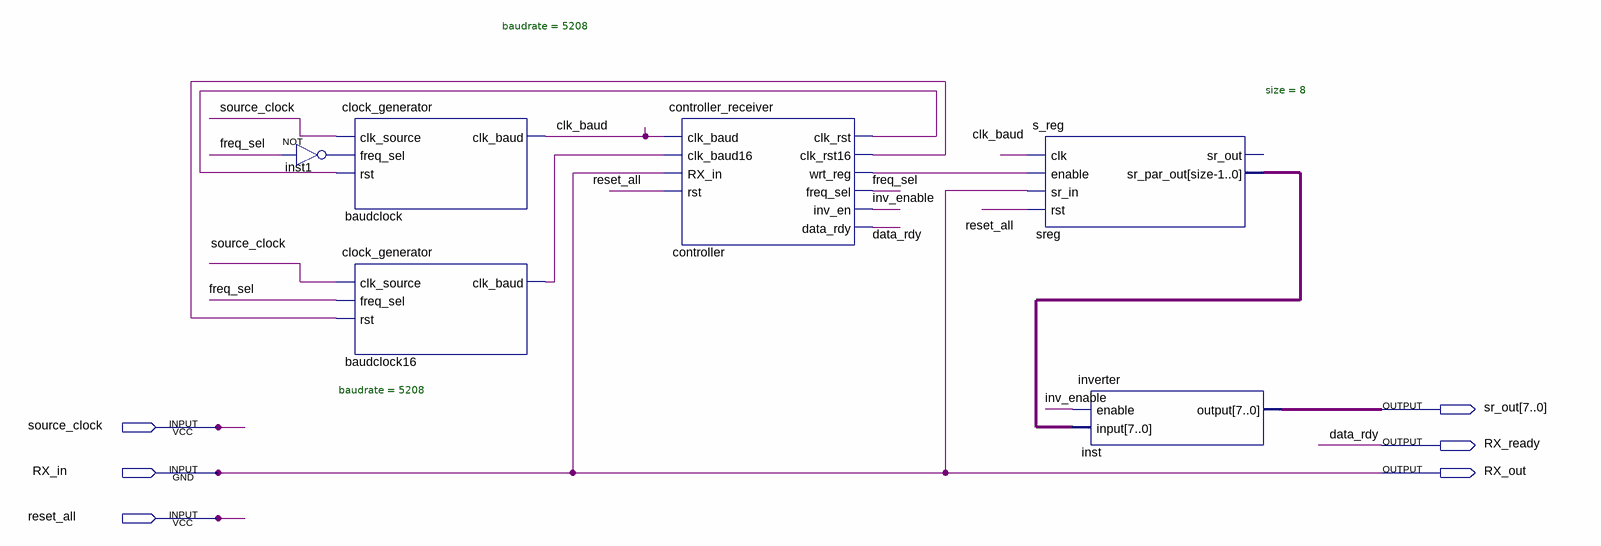
[diagram p0: schematic sheet]
// Quartus schematic incoming_block.bdf as structural Verilog: 6 symbols, 6 pins
module incoming_block (
  input  source_clock,
  input  RX_in,
  input  reset_all,
  output [7:0] sr_out,
  output RX_ready,
  output RX_out
);

  wire baudclock16_clk_baud, clk_baud, controller_clk_rst, controller_clk_rst16, controller_wrt_reg,
       freq_sel, inst1_out, inv_enable;
  wire [7:0] sreg_sr_par_out;

  not inst1 (inst1_out, freq_sel);
  clock_generator #(.baudrate(5208)) baudclock (
    .clk_source(source_clock), .freq_sel(inst1_out), .rst(controller_clk_rst), .clk_baud(clk_baud));
  clock_generator #(.baudrate(5208)) baudclock16 (
    .clk_source(source_clock), .freq_sel(freq_sel), .rst(controller_clk_rst16),
    .clk_baud(baudclock16_clk_baud));
  controller_receiver controller (
    .clk_baud(clk_baud), .clk_baud16(baudclock16_clk_baud), .RX_in(RX_in), .rst(reset_all),
    .clk_rst(controller_clk_rst), .clk_rst16(controller_clk_rst16), .wrt_reg(controller_wrt_reg),
    .freq_sel(freq_sel), .inv_en(inv_enable), .data_rdy(RX_ready));
  s_reg #(.size(8)) sreg (
    .clk(clk_baud), .enable(controller_wrt_reg), .sr_in(RX_in), .rst(reset_all), .sr_par_out(sreg_sr_par_out));  // open: sr_out
  inverter inst (.enable(inv_enable), .\input (sreg_sr_par_out), .\output (sr_out));

  assign RX_out = RX_in;

  // Other names for the same wires on the sheet: data_rdy = RX_ready
endmodule
